# EAGLE design final_3_stages (EAGLE 7.1.0)
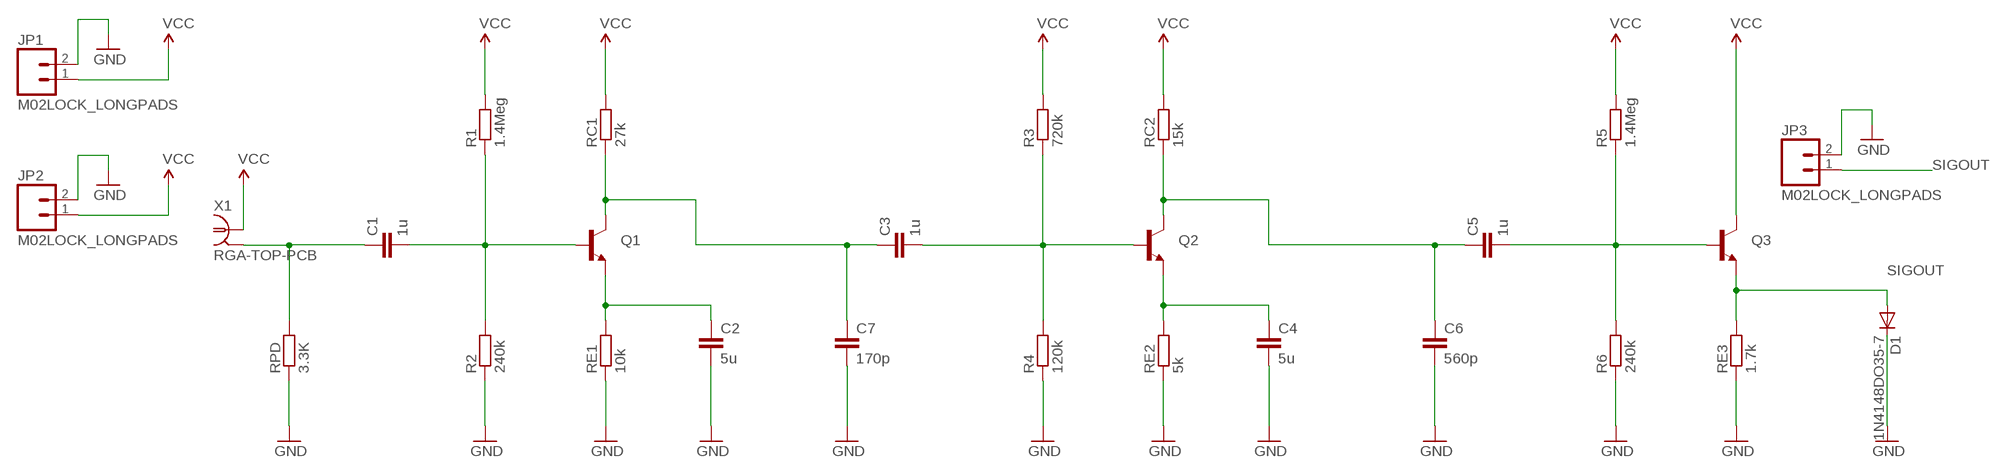
[diagram p0: schematic, sheet 1]

## Parts
C1  1u  CAPKIT  [CAP-PTH-SMALL-KIT]
C2  5u  CAPKIT  [CAP-PTH-SMALL-KIT]
C3  1u  CAPKIT  [CAP-PTH-SMALL-KIT]
C4  5u  CAPKIT  [CAP-PTH-SMALL-KIT]
C5  1u  CAPKIT  [CAP-PTH-SMALL-KIT]
C6  560p  CAPKIT  [CAP-PTH-SMALL-KIT]
C7  170p  CAPKIT  [CAP-PTH-SMALL-KIT]
D1  1N4148DO35-7  [DO35-7]
JP1  M02LOCK_LONGPADS  [1X02_LOCK_LONGPADS]
JP2  M02LOCK_LONGPADS  [1X02_LOCK_LONGPADS]
JP3  M02LOCK_LONGPADS  [1X02_LOCK_LONGPADS]
Q1  TRANSISTOR_NPN2N3904  [TO-92]
Q2  TRANSISTOR_NPN2N3904  [TO-92]
Q3  TRANSISTOR_NPN2N3904  [TO-92]
R1  1.4Meg  R0207/10  [0207/10]
R2  240k  R0207/10  [0207/10]
R3  720k  R0207/10  [0207/10]
R4  120k  R0207/10  [0207/10]
R5  1.4Meg  R0207/10  [0207/10]
R6  240k  R0207/10  [0207/10]
RC1  27k  R0207/10  [0207/10]
RC2  15k  R0207/10  [0207/10]
RE1  10k  R0207/10  [0207/10]
RE2  5k  R0207/10  [0207/10]
RE3  1.7k  R0207/10  [0207/10]
RPD  3.3K  R0207/10  [0207/10]
X1  RGA-TOP-PCB  [BNC-RGA]

## Nets
GND: C2.2 C4.2 C6.2 C7.2 D1.C JP1.2 JP2.2 JP3.2 R2.1 R4.1 R6.1 RE1.1 RE2.1 RE3.1 RPD.1
N$2: C3.1 C7.1 Q1.3(C) RC1.1
N$3: C5.1 C6.1 Q2.3(C) RC2.1
N$4: C1.1 RPD.2 X1.2 X1.3 X1.4 X1.5
N$5: C1.2 Q1.2(B) R1.1 R2.2
N$6: C3.2 Q2.2(B) R3.1 R4.2
N$7: C5.2 Q3.2(B) R5.1 R6.2
N$8: C2.1 Q1.1(E) RE1.2
N$9: C4.1 Q2.1(E) RE2.2
SIGOUT: D1.A JP3.1 Q3.1(E) RE3.2
VCC: JP1.1 JP2.1 Q3.3(C) R1.2 R3.2 R5.2 RC1.2 RC2.2 X1.1

## Library data of the parts
C1-C7 = SparkFun-Capacitors:CAP: Capacitor Standard 0603 ceramic capacitor, and 0.1" leaded capacitor.
D1 = diode:1N4148: DIODE high speed (Philips)
JP1-JP3 = SparkFun-Connectors:M02: Standard 2-pin 0.1" header. Use with - straight break away headers ( PRT-00116) - right angle break away headers (PRT-00553) - swiss pins (PRT-00743) - machine pins (PRT-00117) - female headers (PRT-00115) Molex polarized connector foot print use with: PRT-08233 with associated crimp pins and housings. 2.54_SCREWTERM for use with PRT-10571. 3.5mm Screw Terminal footprints for PRT-08084 5mm Screw Terminal footprints for use with PRT-08432
Q1-Q3 = SparkFun-DiscreteSemi:TRANSISTOR_NPN: Generic NPN BJT MMBT2222A - TRANS-08049 (SOT-23, 1A 40V) MPSA42 - TRANS-09116 (SOT-23, 500mA 300V) MMBT5088LT1G - TRANS-11160 (SOT-23, 50 mA 30V) BC547 - COM-08928 <http://www.sparkfun.com/products/8928> (TO-92 45V 100mA) (1.Collector 2.Base 3.Emitter) 2N3904 - COM-00521 <http://www.sparkfun.com/products/521> (TO-92 40V 200mA) (1.Emitter 2.Base 3.Collector) P2N2222A - COM-12852 <http://www.sparkfun.com/products/12852> (TO-92 40V 600mA) (1.Collector 2.Base 3.Emitter); PROD_ID: TRANS-08447
R1-R6 RC1 RC2 RE1-RE3 RPD = eagle-ltspice:R: RESISTOR, European symbol; SPICEMODEL: NONE; SPICEPREFIX: R
X1 = RGA-BNC-Top-PCB:RGA-TOP-PCB: BNC CONNECTOR RGA PCB Top (Female) From the EE Shop in the back; OC_FARNELL: unknown; OC_NEWARK: unknown

## Board
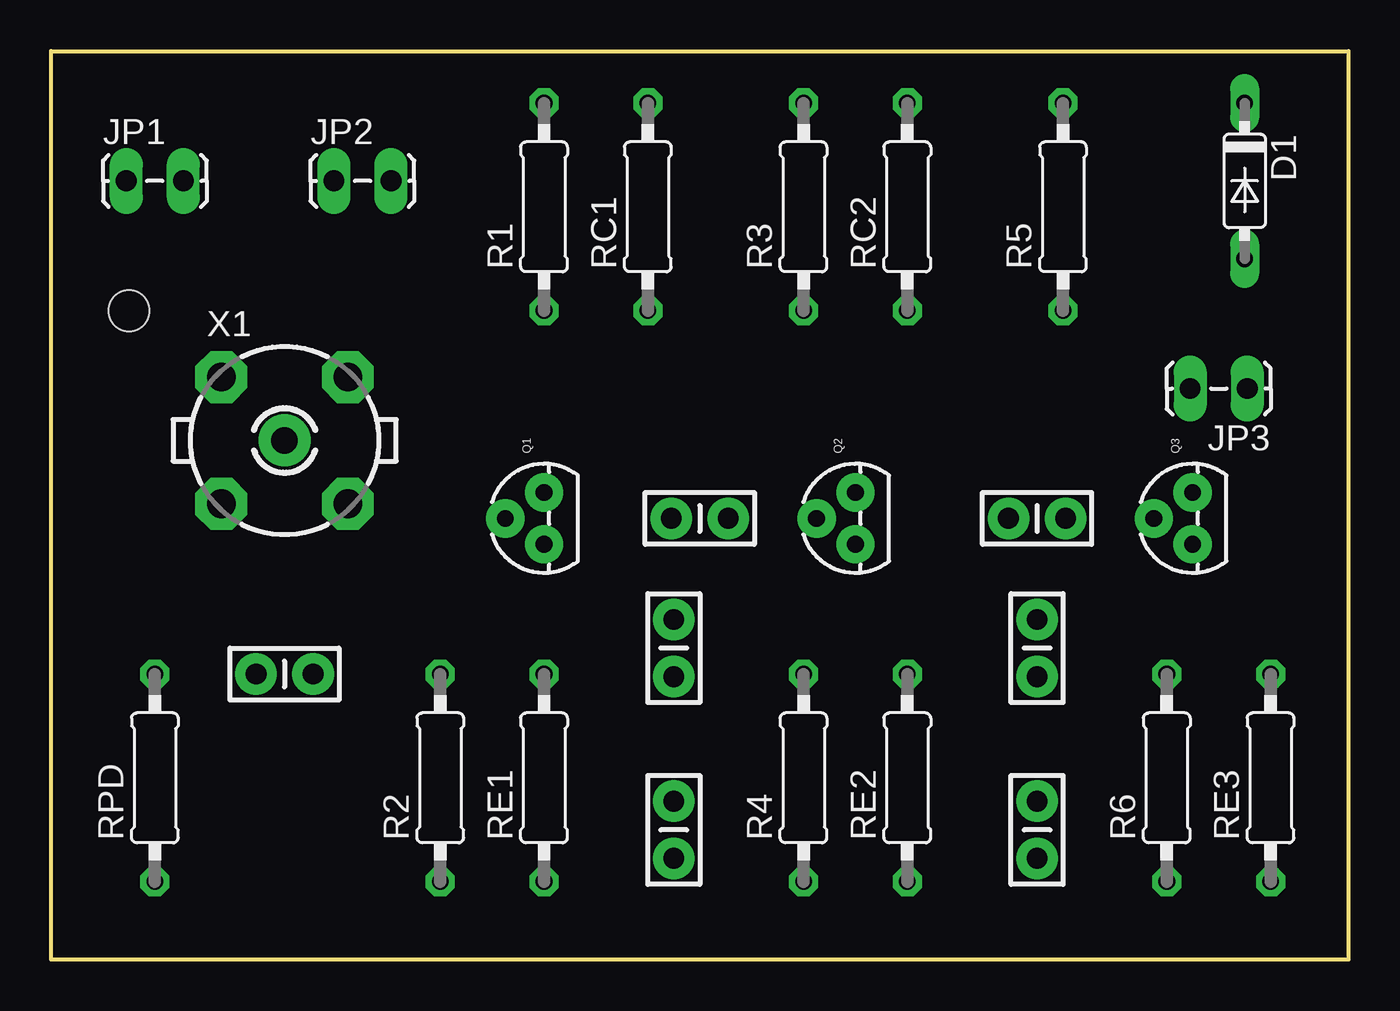
[diagram p1: board, top side]
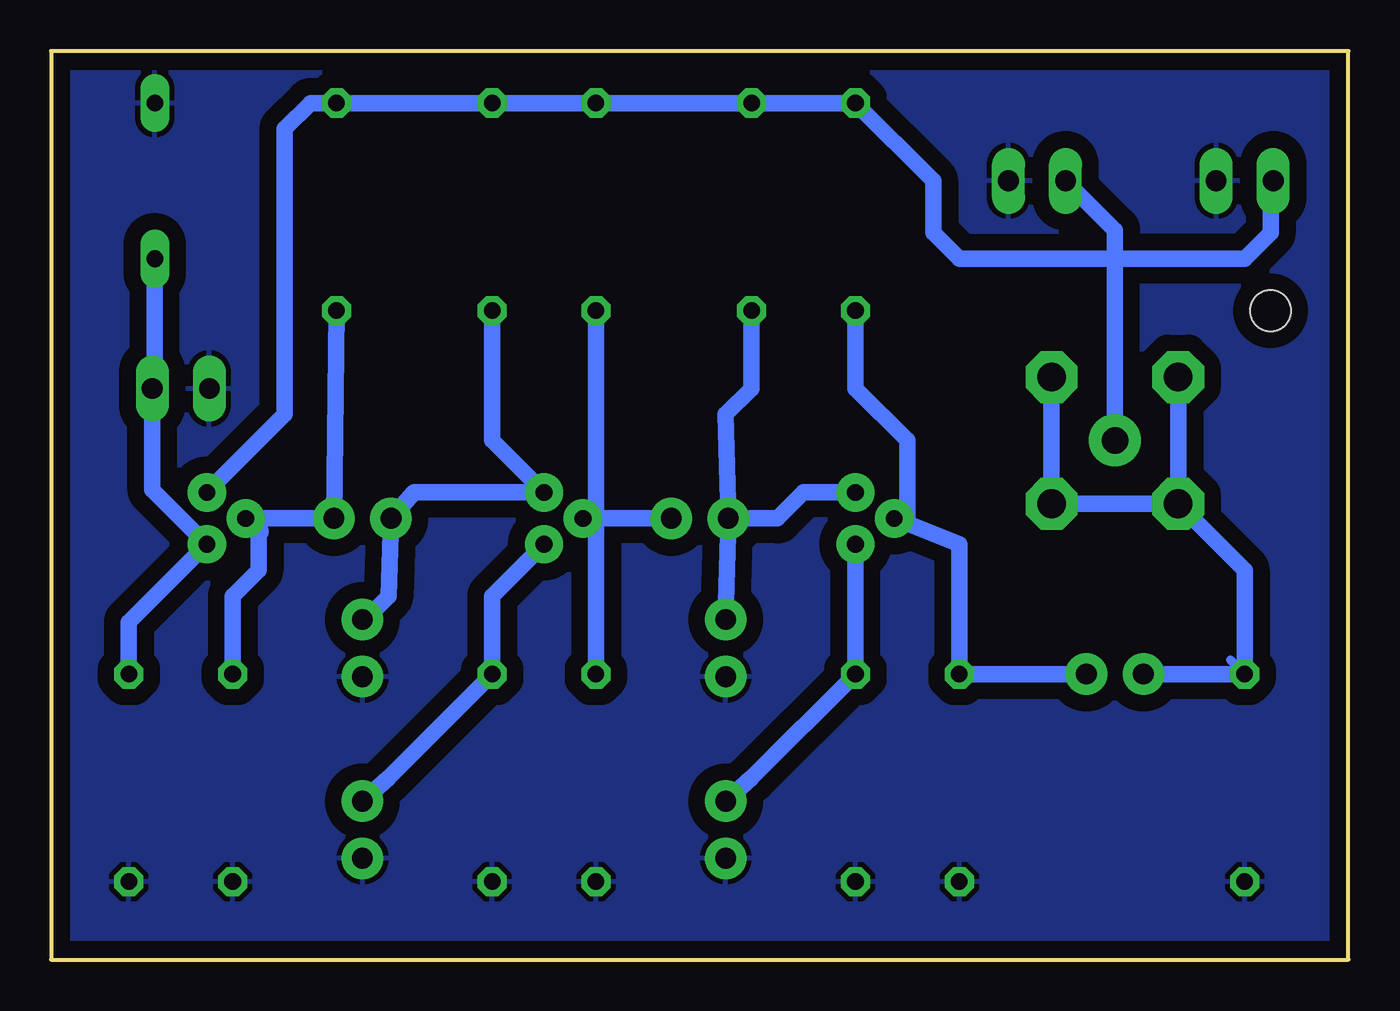
[diagram p2: board, bottom side, seen from below]

Size 63.5 x 44.45 mm. Coordinates in mm from the lower left corner, seen from the top.
Outline: 0,0 0,44.45 63.5,44.45 63.5,0 0,0
Copper layers (1*16): Top 0.035mm / dielectric 1.5mm / Bottom 0.035mm
Design rules "SparkFun": minimum track width 8mil, minimum drill 20mil, track to track 8mil, track to pad 8mil, pad to pad 8mil, via to via 8mil, smd to smd 8mil, copper to edge 8mil, drill to drill 8mil, minimum pad ring 12mil, minimum via ring 10mil, stop-mask expansion 4mil, vias tented up to drill 20mil, thermal gap 10mil
Holes 2 mm at 3.81,31.75

### Footprints (pad centres in the part's own frame; a part is rotated, then mirrored left to right if it is on the bottom)
CAP-PTH-SMALL-KIT = drill 1.016 pad 2.032: 1 -1.397,0; 2 1.397,0
DO35-7 = drill 0.813 long: A 3.81,0; C -3.81,0
1X02_LOCK_LONGPADS = drill 1.016 long: 1 -0.127,0; 2 2.667,0
TO-92 = drill 0.813 pad 1.88: 1 -1.27,0; 2 0,1.905; 3 1.27,0
0207/10 = drill 0.813 octagon: 1 -5.08,0; 2 5.08,0
BNC-RGA = drill 1.3 pad 2.54: 1 0,0 | drill 1.4 pad 2.54 octagon: 2 3.099,3.099; 3 -3.099,3.099; 4 -3.099,-3.099; 5 3.099,-3.099

### Placement (x,y rotation side)
C1  11.43,13.97 0 top
C2  30.48,6.35 270 top
C3  31.75,21.59 0 top
C4  48.26,6.35 270 top
C5  48.26,21.59 0 top
C6  48.26,15.24 270 top
C7  30.48,15.24 270 top
D1  58.42,38.1 270 top
JP1  3.81,38.1 0 top
JP2  13.97,38.1 0 top
JP3  58.42,27.94 180 top
Q1  24.13,21.59 90 top
Q2  39.37,21.59 90 top
Q3  55.88,21.59 90 top
R1  24.13,36.83 90 top
R2  19.05,8.89 90 top
R3  36.83,36.83 90 top
R4  36.83,8.89 90 top
R5  49.53,36.83 90 top
R6  54.61,8.89 90 top
RC1  29.21,36.83 90 top
RC2  41.91,36.83 90 top
RE1  24.13,8.89 90 top
RE2  41.91,8.89 90 top
RE3  59.69,8.89 90 top
RPD  5.08,8.89 90 top
X1  11.43,25.4 0 top

### Tracks (layer width: path | path; a pad name or v marks a point on that pad's centre or on a via)
GND
  pour Bottom (isolate 0.813): 0,0 0,44.45 63.5,44.45 63.5,0
N$2
  Bottom 0.813: RC1.1 29.21,27.94 30.48,26.67 C3.1 | C7.1 C3.1 | Q1.3 26.67,22.86 27.94,21.59 C3.1
N$3
  Bottom 0.813: RC2.1 41.91,25.4 Q2.3 45.72,22.86 C5.1 46.99,17.78 48.26,16.51
  Bottom 1.016: 48.26,16.51 C6.1
N$4
  Bottom 0.406: RPD.2 5.79,14.68
  Bottom 0.813: C1.1 RPD.2 5.08,19.05 X1.4 | X1.4 X1.5 X1.2 | X1.3 X1.4
N$5
  Bottom 0.254: 21.59,21.59 Q1.2
  Bottom 0.813: C1.2 R2.2 19.05,20.32 Q1.2 | R1.1 24.13,27.94 21.59,25.4 21.59,21.59
N$6
  Bottom 0.254: 36.83,21.59 Q2.2
  Bottom 0.813: C3.2 36.83,21.59 | R3.1 36.83,21.59 | 36.83,21.59 R4.2
N$7
  Bottom 0.813: R5.1 C5.2 Q3.2 | 53.34,20.95 53.34,19.05 54.61,17.78 R6.2
  Bottom 1.016: Q3.2 53.34,20.95
N$8
  Bottom 0.813: Q1.1 RE1.2 29.21,8.89 C2.1
N$9
  Bottom 0.813: Q2.1 41.91,17.78 RE2.2 46.99,8.89 C4.1
SIGOUT  (via drill 0.6)
  Top 0.254: JP3.1 v58.42,28.07
  Bottom 0.813: RE3.2 59.69,16.51 Q3.1 58.55,22.99 JP3.1 | v58.42,28.07 D1.A
VCC
  Bottom 0.813: Q3.3 52.07,26.67 52.07,40.64 50.8,41.91 R5.2 RC2.2 R3.2 RC1.2 R1.2 20.32,38.1 20.32,35.56 19.05,34.29 11.43,34.29 | JP2.1 11.43,35.69 11.43,34.29 | 3.81,37.97 3.81,35.56 5.08,34.29 11.43,34.29 | X1.1 11.43,34.29
  Bottom 1.016: JP1.1 3.81,37.97 | JP2.1 13.97,38.23